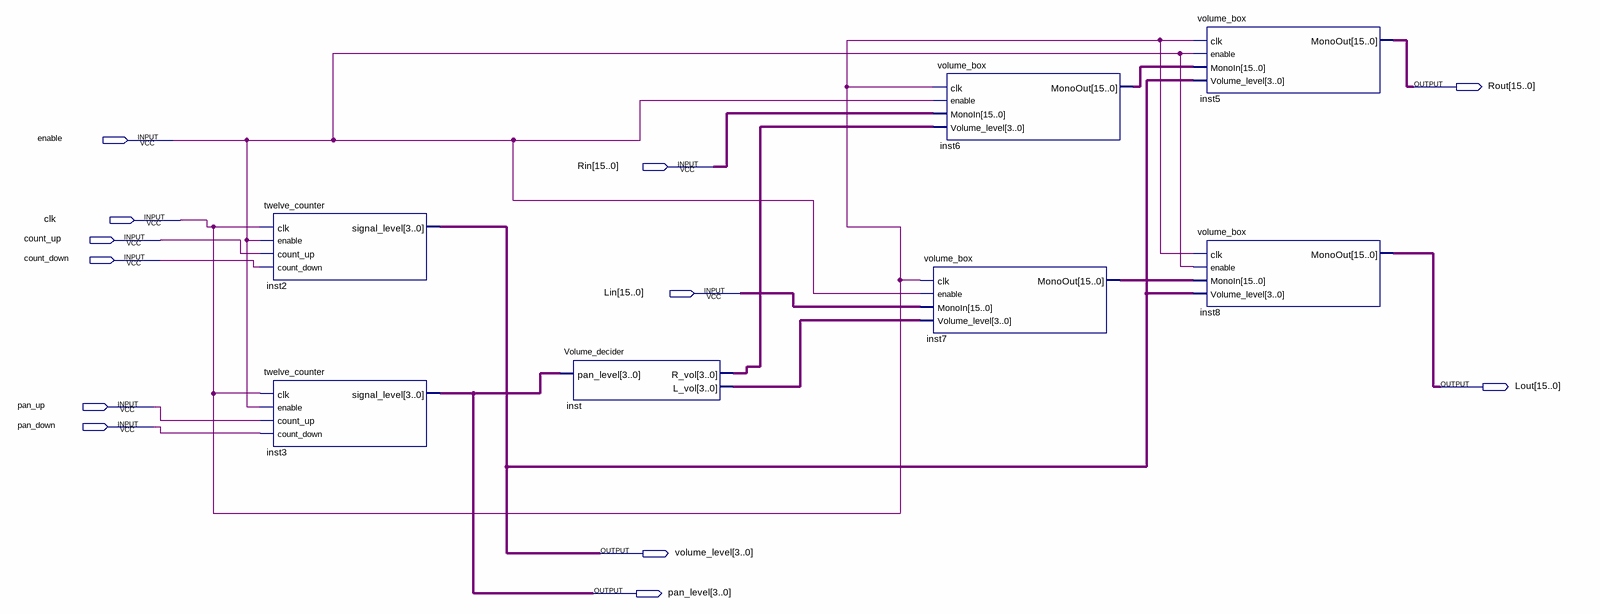
[diagram p0: schematic sheet]
// Quartus schematic volume_control.bdf as structural Verilog: 7 symbols, 12 pins
module volume_control (
  input  enable,
  input  [15:0] Rin,
  input  clk,
  input  count_up,
  input  count_down,
  input  [15:0] Lin,
  input  pan_up,
  input  pan_down,
  output [15:0] Rout,
  output [15:0] Lout,
  output [3:0] volume_level,
  output [3:0] pan_level
);

  wire [3:0] inst_l_vol, inst_r_vol;
  wire [15:0] inst6_monoout, inst7_monoout;

  twelve_counter inst2 (
    .clk(clk), .enable(enable), .count_up(count_up), .count_down(count_down), .signal_level(volume_level));
  twelve_counter inst3 (.clk(clk), .enable(enable), .count_up(pan_up), .count_down(pan_down), .signal_level(pan_level));
  Volume_decider inst (.pan_level(pan_level), .R_vol(inst_r_vol), .L_vol(inst_l_vol));
  volume_box inst7 (.clk(clk), .enable(enable), .MonoIn(Lin), .Volume_level(inst_l_vol), .MonoOut(inst7_monoout));
  volume_box inst6 (.clk(clk), .enable(enable), .MonoIn(Rin), .Volume_level(inst_r_vol), .MonoOut(inst6_monoout));
  volume_box inst5 (.clk(clk), .enable(enable), .MonoIn(inst6_monoout), .Volume_level(volume_level), .MonoOut(Rout));
  volume_box inst8 (.clk(clk), .enable(enable), .MonoIn(inst7_monoout), .Volume_level(volume_level), .MonoOut(Lout));
endmodule
